# EAGLE design V2 (EAGLE 8.5.1)

## Sheet 1 of 4: Main MCU and crystal
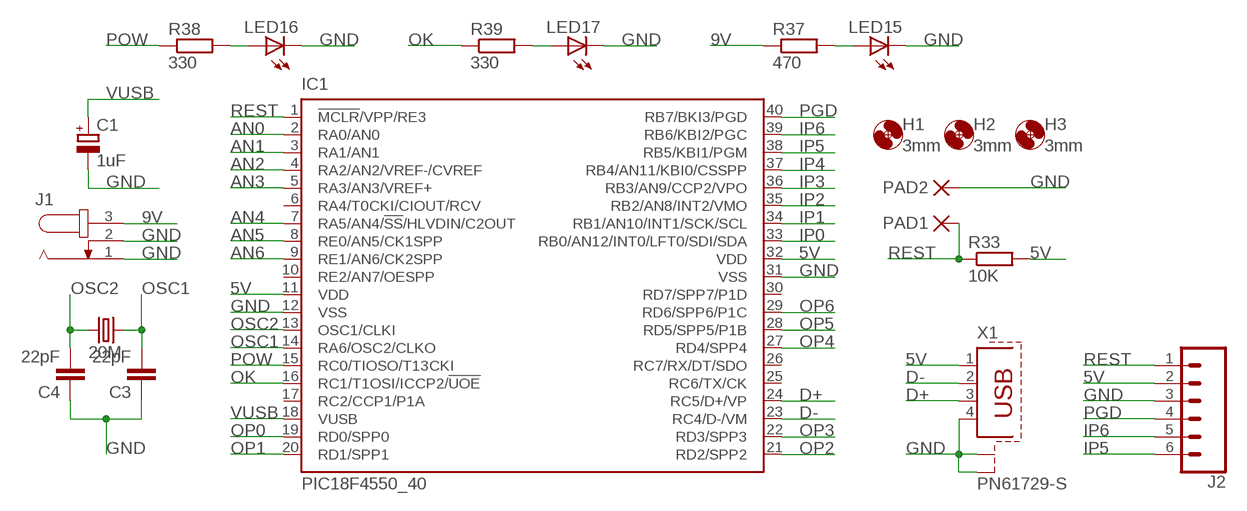
[diagram p0: schematic, sheet 1]

### Parts
20M  CRYSTALHC18U-V  [HC18U-V]
C1  1uF  CPOL-EUE2-5  [E2-5]
C3  22pF  C5/2.5  [C5B2.5]
C4  22pF  C5/2.5  [C5B2.5]
H1  3mm  MOUNT-HOLE3.0  [3,0]
H2  3mm  MOUNT-HOLE3.0  [3,0]
H3  3mm  MOUNT-HOLE3.0  [3,0]
IC1  PIC18F4550_40  [DIL40]
J1  JACK-PLUG0  [SPC4077]
J2  CONN_06LONGPADS  [1X06_LONGPADS]
LED15  LED5MM  [LED5MM]
LED16  LED5MM  [LED5MM]
LED17  LED5MM  [LED5MM]
PAD1  PAD-0320  [0320]
PAD2  PAD-0320  [0320]
R33  10K  R-EU_0207/10  [0207/10]
R37  470  R-EU_0207/10  [0207/10]
R38  330  R-EU_0207/10  [0207/10]
R39  330  R-EU_0207/10  [0207/10]
X1  PN61729-S  [PN61729-S]

### Nets
5V: IC1.11(VDD) IC1.32(VDD) J2.2 R33.2 X1.1 ; also sheet 2
9V: J1.3 R37.1 ; also sheet 4
AN0: IC1.2(RA0/AN0) ; also sheet 4
AN1: IC1.3(RA1/AN1) ; also sheet 4
AN2: IC1.4(RA2/AN2/VREF-/CVREF) ; also sheet 4
AN3: IC1.5(RA3/AN3/VREF+) ; also sheet 4
AN4: IC1.7(RA5/AN4/!SS!/HLVDIN/C2OUT) ; also sheet 4
AN5: IC1.8(RE0/AN5/CK1SPP) ; also sheet 4
AN6: IC1.9(RE1/AN6/CK2SPP) ; also sheet 4
D+: IC1.24(RC5/D+/VP) X1.3
D-: IC1.23(RC4/D-/VM) X1.2
GND: C1.- C3.1 C4.1 IC1.12(VSS) IC1.31(VSS) J1.1 J1.2 J2.3 LED15.K(C) LED16.K(C) LED17.K(C) PAD2.P$1(P) X1.4 X1.S1 X1.S2 ; also sheet 2,3,4
IP0: IC1.33(RB0/AN12/INT0/LFT0/SDI/SDA) ; also sheet 2
IP1: IC1.34(RB1/AN10/INT1/SCK/SCL) ; also sheet 2
IP2: IC1.35(RB2/AN8/INT2/VMO) ; also sheet 2
IP3: IC1.36(RB3/AN9/CCP2/VPO) ; also sheet 2
IP4: IC1.37(RB4/AN11/KBI0/CSSPP) ; also sheet 2
IP5: IC1.38(RB5/KBI1/PGM) J2.6 ; also sheet 2
IP6: IC1.39(RB6/KBI2/PGC) J2.5 ; also sheet 2
N$36: LED15.A R37.2
N$37: LED16.A R38.2
N$38: LED17.A R39.2
OK: IC1.16(RC1/T1OSI/ICCP2/!UOE) R39.1
OP0: IC1.19(RD0/SPP0) ; also sheet 3
OP1: IC1.20(RD1/SPP1) ; also sheet 3
OP2: IC1.21(RD2/SPP2) ; also sheet 3
OP3: IC1.22(RD3/SPP3) ; also sheet 3
OP4: IC1.27(RD4/SPP4) ; also sheet 3
OP5: IC1.28(RD5/SPP5/P1B) ; also sheet 3
OP6: IC1.29(RD6/SPP6/P1C) ; also sheet 3
OSC1: 20M.2 C3.2 IC1.14(RA6/OSC2/CLKO)
OSC2: 20M.1 C4.2 IC1.13(OSC1/CLKI)
PGD: IC1.40(RB7/BKI3/PGD) J2.4
POW: IC1.15(RC0/TIOSO/T13CKI) R38.1
REST: IC1.1(!MCLR!/VPP/RE3) J2.1 PAD1.P$1(P) R33.1
VUSB: C1.+ IC1.18(VUSB)
Unconnected: IC1.6(RA4/T0CKI/CIOUT/RCV) IC1.10(RE2/AN7/OESPP) IC1.17(RC2/CCP1/P1A) IC1.25(RC6/TX/CK) IC1.26(RC7/RX/DT/SDO) IC1.30(RD7/SPP7/P1D)

## Sheet 2 of 4: Input Protection
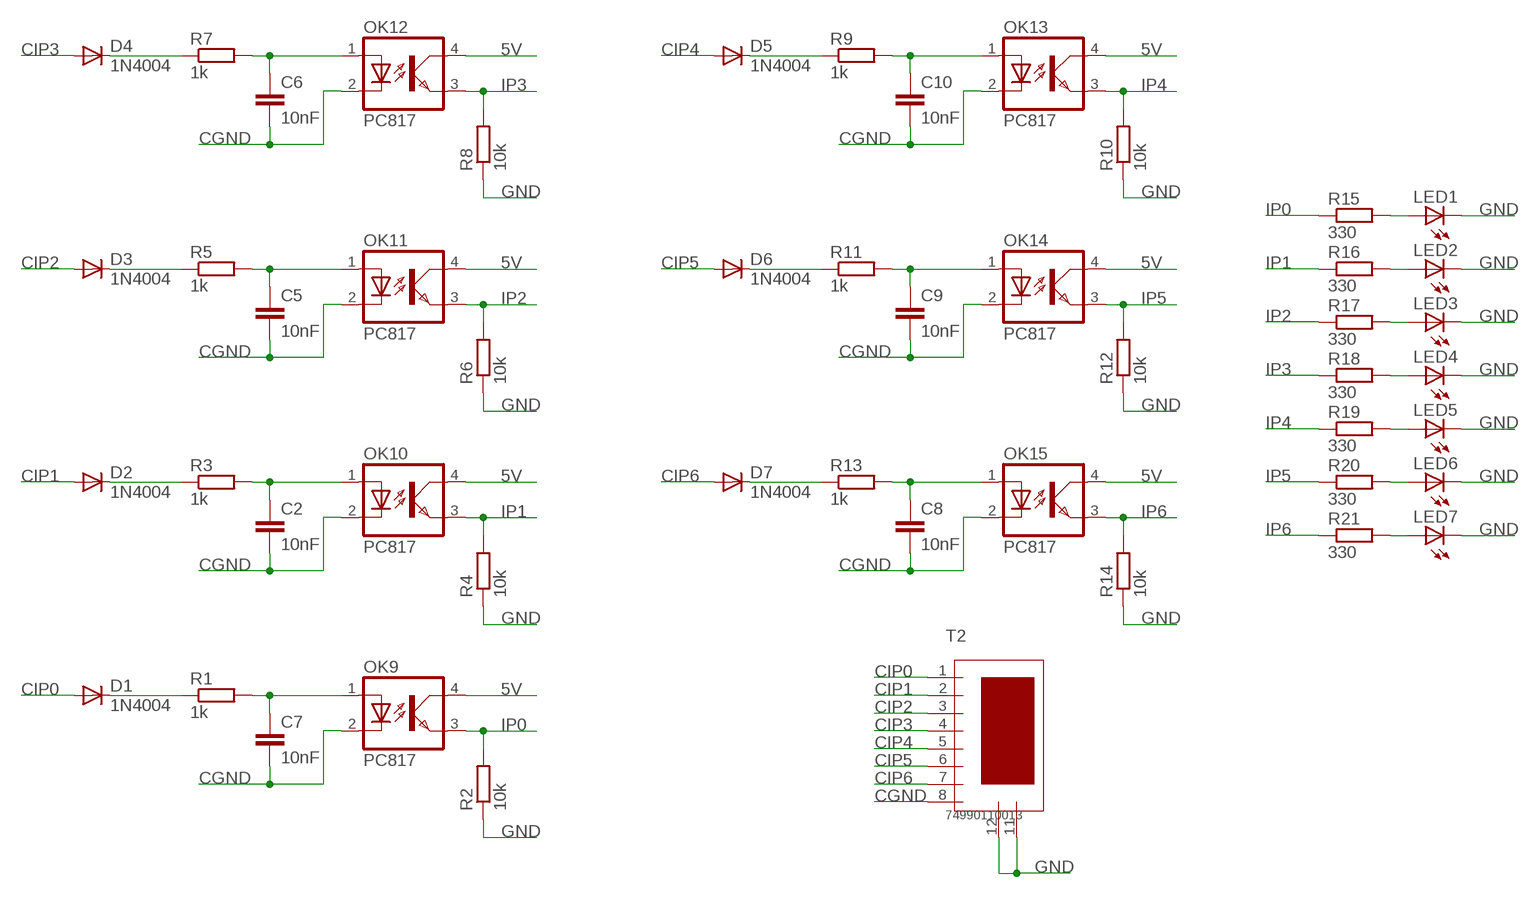
[diagram p1: schematic, sheet 2]

### Parts
C2  10nF  C5/2.5  [C5B2.5]
C5  10nF  C5/2.5  [C5B2.5]
C6  10nF  C5/2.5  [C5B2.5]
C7  10nF  C5/2.5  [C5B2.5]
C8  10nF  C5/2.5  [C5B2.5]
C9  10nF  C5/2.5  [C5B2.5]
C10  10nF  C5/2.5  [C5B2.5]
D1  1N4004  [DO41-10]
D2  1N4004  [DO41-10]
D3  1N4004  [DO41-10]
D4  1N4004  [DO41-10]
D5  1N4004  [DO41-10]
D6  1N4004  [DO41-10]
D7  1N4004  [DO41-10]
LED1  LED5MM  [LED5MM]
LED2  LED5MM  [LED5MM]
LED3  LED5MM  [LED5MM]
LED4  LED5MM  [LED5MM]
LED5  LED5MM  [LED5MM]
LED6  LED5MM  [LED5MM]
LED7  LED5MM  [LED5MM]
OK9  PC817  [DIL04]
OK10  PC817  [DIL04]
OK11  PC817  [DIL04]
OK12  PC817  [DIL04]
OK13  PC817  [DIL04]
OK14  PC817  [DIL04]
OK15  PC817  [DIL04]
R1  1k  R-EU_0207/10  [0207/10]
R2  10k  R-EU_0207/10  [0207/10]
R3  1k  R-EU_0207/10  [0207/10]
R4  10k  R-EU_0207/10  [0207/10]
R5  1k  R-EU_0207/10  [0207/10]
R6  10k  R-EU_0207/10  [0207/10]
R7  1k  R-EU_0207/10  [0207/10]
R8  10k  R-EU_0207/10  [0207/10]
R9  1k  R-EU_0207/10  [0207/10]
R10  10k  R-EU_0207/10  [0207/10]
R11  1k  R-EU_0207/10  [0207/10]
R12  10k  R-EU_0207/10  [0207/10]
R13  1k  R-EU_0207/10  [0207/10]
R14  10k  R-EU_0207/10  [0207/10]
R15  330  R-EU_0207/10  [0207/10]
R16  330  R-EU_0207/10  [0207/10]
R17  330  R-EU_0207/10  [0207/10]
R18  330  R-EU_0207/10  [0207/10]
R19  330  R-EU_0207/10  [0207/10]
R20  330  R-EU_0207/10  [0207/10]
R21  330  R-EU_0207/10  [0207/10]
T2  74990110013  [01LAN_RJ45_10/00_STD]

### Nets
5V: OK9.4(COL) OK10.4(COL) OK11.4(COL) OK12.4(COL) OK13.4(COL) OK14.4(COL) OK15.4(COL) ; also sheet 1
CGND: C2.2 C5.2 C6.2 C7.2 C8.2 C9.2 C10.2 OK9.2(C) OK10.2(C) OK11.2(C) OK12.2(C) OK13.2(C) OK14.2(C) OK15.2(C) T2.8
CIP0: D1.A T2.1
CIP1: D2.A T2.2
CIP2: D3.A T2.3
CIP3: D4.A T2.4
CIP4: D5.A T2.5
CIP5: D6.A T2.6
CIP6: D7.A T2.7
GND: LED1.K(C) LED2.K(C) LED3.K(C) LED4.K(C) LED5.K(C) LED6.K(C) LED7.K(C) R2.1 R4.1 R6.1 R8.1 R10.1 R12.1 R14.1 T2.11 T2.12 ; also sheet 1,3,4
IP0: OK9.3(EMIT) R2.2 R15.1 ; also sheet 1
IP1: OK10.3(EMIT) R4.2 R16.1 ; also sheet 1
IP2: OK11.3(EMIT) R6.2 R17.1 ; also sheet 1
IP3: OK12.3(EMIT) R8.2 R18.1 ; also sheet 1
IP4: OK13.3(EMIT) R10.2 R19.1 ; also sheet 1
IP5: OK14.3(EMIT) R12.2 R20.1 ; also sheet 1
IP6: OK15.3(EMIT) R14.2 R21.1 ; also sheet 1
N$1: D1.C R1.1
N$2: C7.1 OK9.1(A) R1.2
N$3: D2.C R3.1
N$5: C2.1 OK10.1(A) R3.2
N$7: D3.C R5.1
N$8: C5.1 OK11.1(A) R5.2
N$9: D4.C R7.1
N$10: C6.1 OK12.1(A) R7.2
N$11: D5.C R9.1
N$12: C10.1 OK13.1(A) R9.2
N$13: D6.C R11.1
N$14: C9.1 OK14.1(A) R11.2
N$16: D7.C R13.1
N$17: C8.1 OK15.1(A) R13.2
N$18: LED1.A R15.2
N$19: LED2.A R16.2
N$22: LED3.A R17.2
N$23: LED4.A R18.2
N$24: LED5.A R19.2
N$25: LED6.A R20.2
N$26: LED7.A R21.2

## Sheet 3 of 4: Output Protection
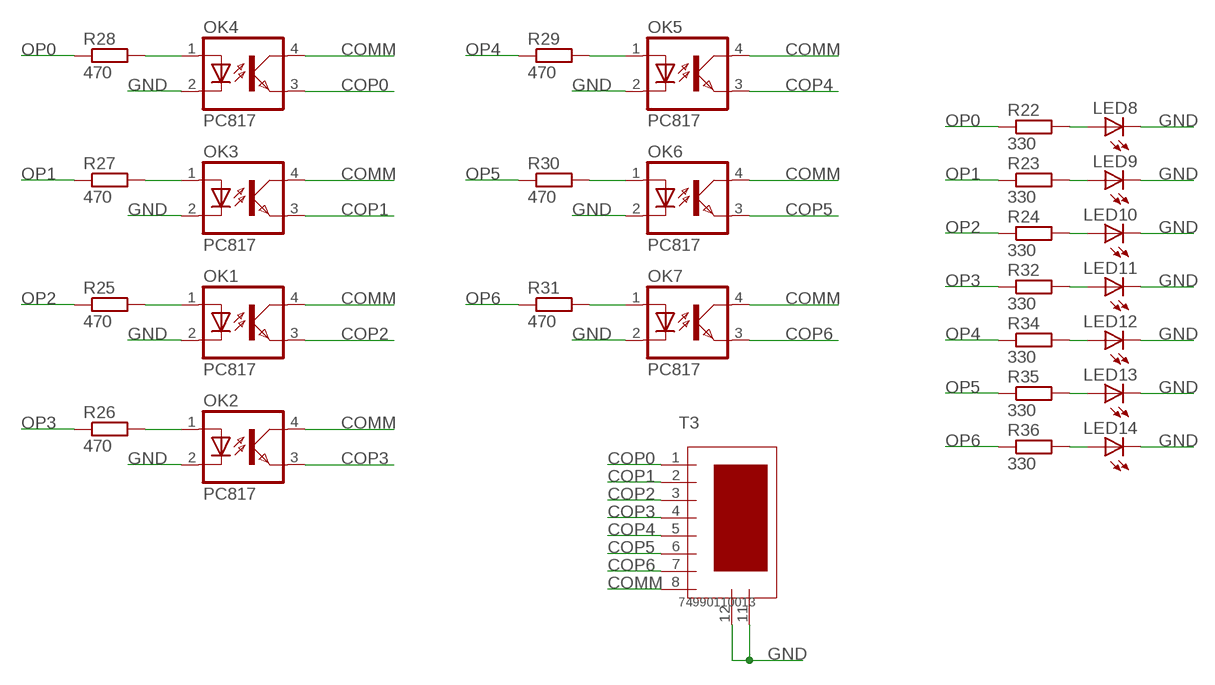
[diagram p2: schematic, sheet 3]

### Parts
LED8  LED5MM  [LED5MM]
LED9  LED5MM  [LED5MM]
LED10  LED5MM  [LED5MM]
LED11  LED5MM  [LED5MM]
LED12  LED5MM  [LED5MM]
LED13  LED5MM  [LED5MM]
LED14  LED5MM  [LED5MM]
OK1  PC817  [DIL04]
OK2  PC817  [DIL04]
OK3  PC817  [DIL04]
OK4  PC817  [DIL04]
OK5  PC817  [DIL04]
OK6  PC817  [DIL04]
OK7  PC817  [DIL04]
R22  330  R-EU_0207/10  [0207/10]
R23  330  R-EU_0207/10  [0207/10]
R24  330  R-EU_0207/10  [0207/10]
R25  470  R-EU_0207/10  [0207/10]
R26  470  R-EU_0207/10  [0207/10]
R27  470  R-EU_0207/10  [0207/10]
R28  470  R-EU_0207/10  [0207/10]
R29  470  R-EU_0207/10  [0207/10]
R30  470  R-EU_0207/10  [0207/10]
R31  470  R-EU_0207/10  [0207/10]
R32  330  R-EU_0207/10  [0207/10]
R34  330  R-EU_0207/10  [0207/10]
R35  330  R-EU_0207/10  [0207/10]
R36  330  R-EU_0207/10  [0207/10]
T3  74990110013  [01LAN_RJ45_10/00_STD]

### Nets
COMM: OK1.4(COL) OK2.4(COL) OK3.4(COL) OK4.4(COL) OK5.4(COL) OK6.4(COL) OK7.4(COL) T3.8
COP0: OK4.3(EMIT) T3.1
COP1: OK3.3(EMIT) T3.2
COP2: OK1.3(EMIT) T3.3
COP3: OK2.3(EMIT) T3.4
COP4: OK5.3(EMIT) T3.5
COP5: OK6.3(EMIT) T3.6
COP6: OK7.3(EMIT) T3.7
GND: LED8.K(C) LED9.K(C) LED10.K(C) LED11.K(C) LED12.K(C) LED13.K(C) LED14.K(C) OK1.2(C) OK2.2(C) OK3.2(C) OK4.2(C) OK5.2(C) OK6.2(C) OK7.2(C) T3.11 T3.12 ; also sheet 1,2,4
N$4: OK1.1(A) R25.2
N$6: OK2.1(A) R26.2
N$15: OK3.1(A) R27.2
N$20: OK4.1(A) R28.2
N$21: LED8.A R22.2
N$27: OK5.1(A) R29.2
N$28: LED9.A R23.2
N$29: LED10.A R24.2
N$30: LED11.A R32.2
N$31: LED12.A R34.2
N$32: OK6.1(A) R30.2
N$33: LED13.A R35.2
N$34: LED14.A R36.2
N$35: OK7.1(A) R31.2
OP0: R22.1 R28.1 ; also sheet 1
OP1: R23.1 R27.1 ; also sheet 1
OP2: R24.1 R25.1 ; also sheet 1
OP3: R26.1 R32.1 ; also sheet 1
OP4: R29.1 R34.1 ; also sheet 1
OP5: R30.1 R35.1 ; also sheet 1
OP6: R31.1 R36.1 ; also sheet 1

## Sheet 4 of 4: Analog Protection
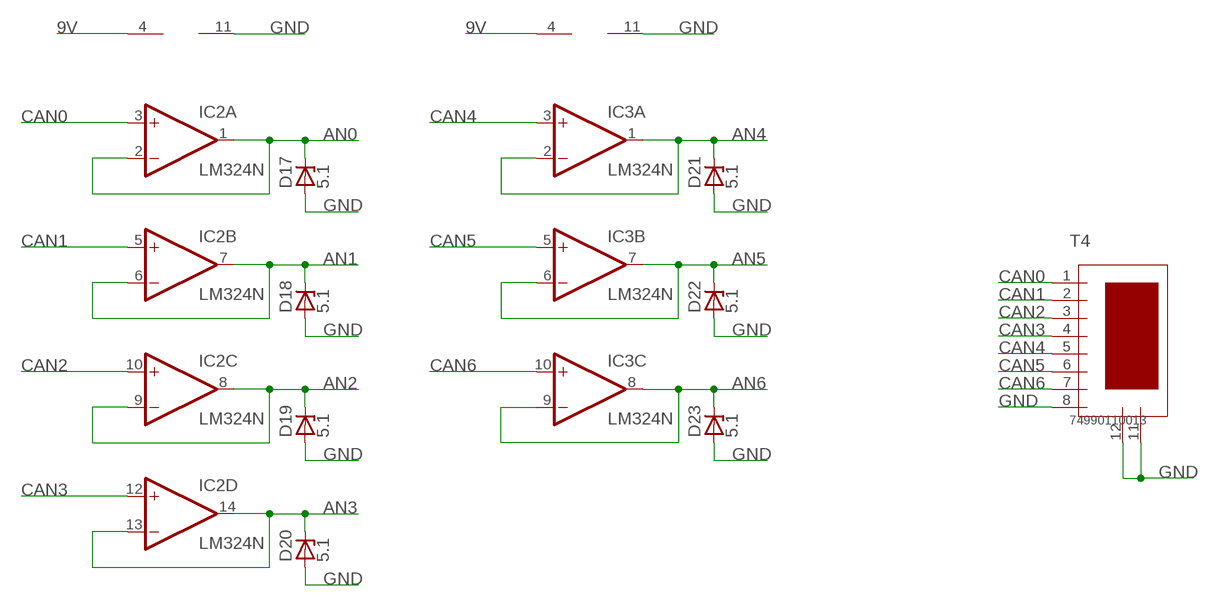
[diagram p3: schematic, sheet 4]

### Parts
D17  5.1  ZENER-DIODEZD-10  [ZDIO-10]
D18  5.1  ZENER-DIODEZD-10  [ZDIO-10]
D19  5.1  ZENER-DIODEZD-10  [ZDIO-10]
D20  5.1  ZENER-DIODEZD-10  [ZDIO-10]
D21  5.1  ZENER-DIODEZD-10  [ZDIO-10]
D22  5.1  ZENER-DIODEZD-10  [ZDIO-10]
D23  5.1  ZENER-DIODEZD-10  [ZDIO-10]
IC2  LM324N  [DIL14]
IC3  LM324N  [DIL14]
T4  74990110013  [01LAN_RJ45_10/00_STD]

### Nets
9V: IC2.4(P:V+) IC3.4(P:V+) ; also sheet 1
AN0: D17.C IC2.1(A:OUT) IC2.2(A:-IN) ; also sheet 1
AN1: D18.C IC2.6(B:-IN) IC2.7(B:OUT) ; also sheet 1
AN2: D19.C IC2.8(C:OUT) IC2.9(C:-IN) ; also sheet 1
AN3: D20.C IC2.13(D:-IN) IC2.14(D:OUT) ; also sheet 1
AN4: D21.C IC3.1(A:OUT) IC3.2(A:-IN) ; also sheet 1
AN5: D22.C IC3.6(B:-IN) IC3.7(B:OUT) ; also sheet 1
AN6: D23.C IC3.8(C:OUT) IC3.9(C:-IN) ; also sheet 1
CAN0: IC2.3(A:+IN) T4.1
CAN1: IC2.5(B:+IN) T4.2
CAN2: IC2.10(C:+IN) T4.3
CAN3: IC2.12(D:+IN) T4.4
CAN4: IC3.3(A:+IN) T4.5
CAN5: IC3.5(B:+IN) T4.6
CAN6: IC3.10(C:+IN) T4.7
GND: D17.A D18.A D19.A D20.A D21.A D22.A D23.A IC2.11(P:V-) IC3.11(P:V-) T4.8 T4.11 T4.12 ; also sheet 1,2,3
Unconnected: IC3.12(D:+IN) IC3.13(D:-IN) IC3.14(D:OUT)

## Library data of the parts
20M = adafruit:CRYSTAL: CRYSTAL; OC_FARNELL: unknown; OC_NEWARK: unknown
C1 = rcl:CPOL-EU: POLARIZED CAPACITOR, European symbol; SPICEPREFIX: C
C2-C10 = capacitor-wima:C: CAPACITOR naming: grid - package width
D1-D7 = adafruit:1N4004: DIODE General purpose 1N400x type rectifier (With bigger pads) http://www.ladyada.net/library/pcb/eaglelibrary.html
D17-D23 = diode-1:ZENER-DIODE: Z-Diode
H1-H3 = holes:MOUNT-HOLE: MOUNTING HOLE with drill center marker
IC1 = microchip:PIC18F4*_40: USB Microcontrollers with nanoWatt Technology High-Performance, Enhanced Flash, 28/40/44-Pin, Source: http://ww1.microchip.com/downloads/en/devicedoc/39632c.pdf; MF: MICROCHIP; MPN: PIC18F4550-I/P; OC_FARNELL: 9321357; OC_NEWARK: 74K8623
IC2 IC3 = linear:LM324: OP AMP
J1 = con-jack:JACK-PLUG: DC POWER JACK Power Jack, DC, Right Angle, Through Hole, Rated 5A at 16VDC, PC Terminals Distributor: Farnell (www.Farnell.de) Drawing: 84N1161.pdf / 84N1162.pdf Manufacturer: SPC Technology (www.spctechnology.com) Type: SPC4077 / SPC 4078; OC_FARNELL: unknown; OC_NEWARK: unknown
J2 = SparkFun-Connectors:CONN_06: Multi connection point. Often used as Generic Header-pin footprint for 0.1 inch spaced/style header connections On any of the 0.1 inch spaced packages, you can populate with these: Break Away Headers - Straight <https://www.sparkfun.com/products/116> (PRT-00116) Break Away Male Headers - Right Angle <https://www.sparkfun.com/products/553> (PRT-00553) Female Headers <https://www.sparkfun.com/products/115> (PRT-00115) Break Away Headers - Machine Pin <https://www.sparkfun.com/products/117> (PRT-00117) Break Away Female Headers - Swiss Machine Pin <https://www.sparkfun.com/products/743> (PRT-00743) Arduino Stackable Header - 6 Pin <https://www.sparkfun.com/products/9280> (PRT-09280) For SCREWTERMINALS and SPRING TERMINALS visit here: Screw Terimnals on SparkFun.com <https://www.sparkfun.com/search/results?term=Screw+Terminals> (5mm/3.5mm/2.54mm spacing) This device is also useful as a general connection point to wire up your design to another part of your project. Our various solder wires solder well into these plated through hole pads. Hook-Up Wire - Assortment (Stranded, 22 AWG) <https://www.sparkfun.com/products/11375> (PRT-11375) Hook-Up Wire - Assortment (Solid Core, 22 AWG) <https://www.sparkfun.com/products/11367> (PRT-11367) View the entire wire category on our website here <https://www.sparkfun.com/categories/141>
LED1-LED17 = led:LED: LED OSRAM: - CHIPLED LG R971, LG N971, LY N971, LG Q971, LY Q971, LO R971, LY R971 LH N974, LH R974 LS Q976, LO Q976, LY Q976 LO Q996 - Hyper CHIPLED LW Q18S LB Q993, LB Q99A, LB R99A - SideLED LS A670, LO A670, LY A670, LG A670, LP A670 LB A673, LV A673, LT A673, LW A673 LH A674 LY A675 LS A676, LA A676, LO A676, LY A676, LW A676 LS A679, LY A679, LG A679 - Hyper Micro SIDELED® LS Y876, LA Y876, LO Y876, LY Y876 LT Y87S - SmartLED LW L88C, LW L88S LB L89C, LB L89S, LG L890 LS L89K, LO L89K, LY L89K LS L896, LA L896, LO L896, LY L896 - TOPLED LS T670, LO T670, LY T670, LG T670, LP T670 LSG T670, LSP T670, LSY T670, LOP T670, LYG T670 LG T671, LOG T671, LSG T671 LB T673, LV T673, LT T673, LW T673 LH T674 LS T676, LA T676, LO T676, LY T676, LB T676, LH T676, LSB T676, LW T676 LB T67C, LV T67C, LT T67C, LS T67K, LO T67K, LY T67K, LW E67C LS E67B, LA E67B, LO E67B, LY E67B, LB E67C, LV E67C, LT E67C LW T67C LS T679, LY T679, LG T679 LS T770, LO T770, LY T770, LG T770, LP T770 LB T773, LV T773, LT T773, LW T773 LH T774 LS E675, LA E675, LY E675, LS T675 LS T776, LA T776, LO T776, LY T776, LB T776 LHGB T686 LT T68C, LB T68C - Hyper Mini TOPLED® LB M676 - Mini TOPLED Santana® LG M470 LS M47K, LO M47K, LY M47K Source: http://www.osram.convergy.de LUXEON: - LUMILED® LXK2-PW12-R00, LXK2-PW12-S00, LXK2-PW14-U00, LXK2-PW14-V00 LXK2-PM12-R00, LXK2-PM12-S00, LXK2-PM14-U00 LXK2-PE12-Q00, LXK2-PE12-R00, LXK2-PE12-S00, LXK2-PE14-T00, LXK2-PE14-U00 LXK2-PB12-K00, LXK2-PB12-L00, LXK2-PB12-M00, LXK2-PB14-N00, LXK2-PB14-P00, LXK2-PB14-Q00 LXK2-PR12-L00, LXK2-PR12-M00, LXK2-PR14-Q00, LXK2-PR14-R00 LXK2-PD12-Q00, LXK2-PD12-R00, LXK2-PD12-S00 LXK2-PH12-R00, LXK2-PH12-S00 LXK2-PL12-P00, LXK2-PL12-Q00, LXK2-PL12-R00 Source: www.luxeon.com KINGBRIGHT: KA-3528ASYC Source: www.kingbright.com
OK1-OK7 OK9-OK15 = optocoupler:PC817: SHARP OPTO COUPLER; MPN: PC817X4J000F; OC_FARNELL: 9707727; OC_NEWARK: 97K7059
PAD1 PAD2 = dpads:PAD: WIRE PAD Standard US Drill Sizes and SMD pads
R1-R24 R32 R34-R39 = rcl:R-EU_: RESISTOR, European symbol; SPICEPREFIX: R
R25-R31 R33 = rcl:R-EU_: RESISTOR, European symbol
T2-T4 = wurth_electronics_midcom_inc_v1-0:74990110013: Package Style: HPLE RJ45 10/100 STD Mounting: THT LED: None Shield: 293-0533 Header: 183-0132 Windings Primary: Aux: Secondary: Best pinouts for production vary per application. Please contact Wurth Electronics Midcom, Inc. for assistance with your custom design. Datasheet: 74990110013 <http://katalog.we-online.de/kataloge/eisos/media/pdf/74990110013.pdf> Website: Wurth Electronics Midcom <http://www.we-online.com/midcom> Contact us Wurth Electronics Midcom, Inc. 121 Airport Dr. Watertown, SD 57201 Phone: (605) 886-4385 Fax: (605) 886-4486 E-Mail: midcom@we-online.com
X1 = con-berg:PN61729-S: BERG USB connector; OC_FARNELL: unknown; OC_NEWARK: unknown

## Board
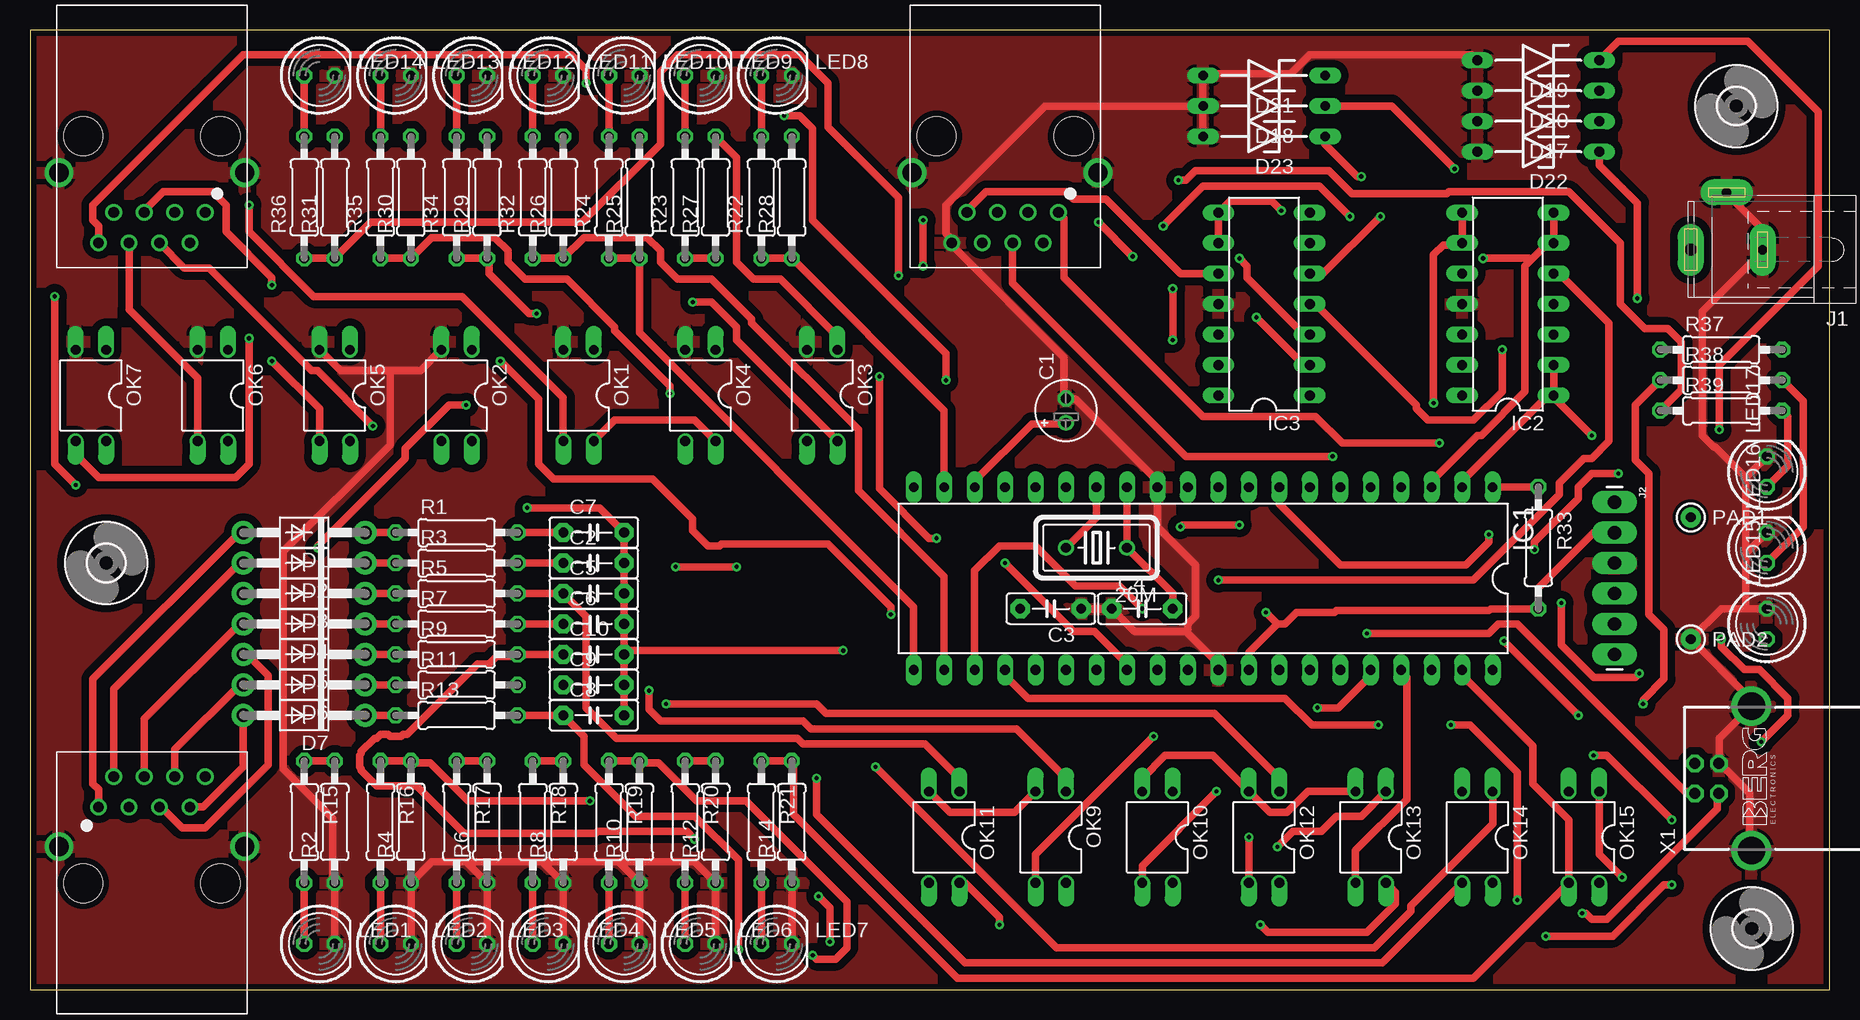
[diagram p4: board, top side]
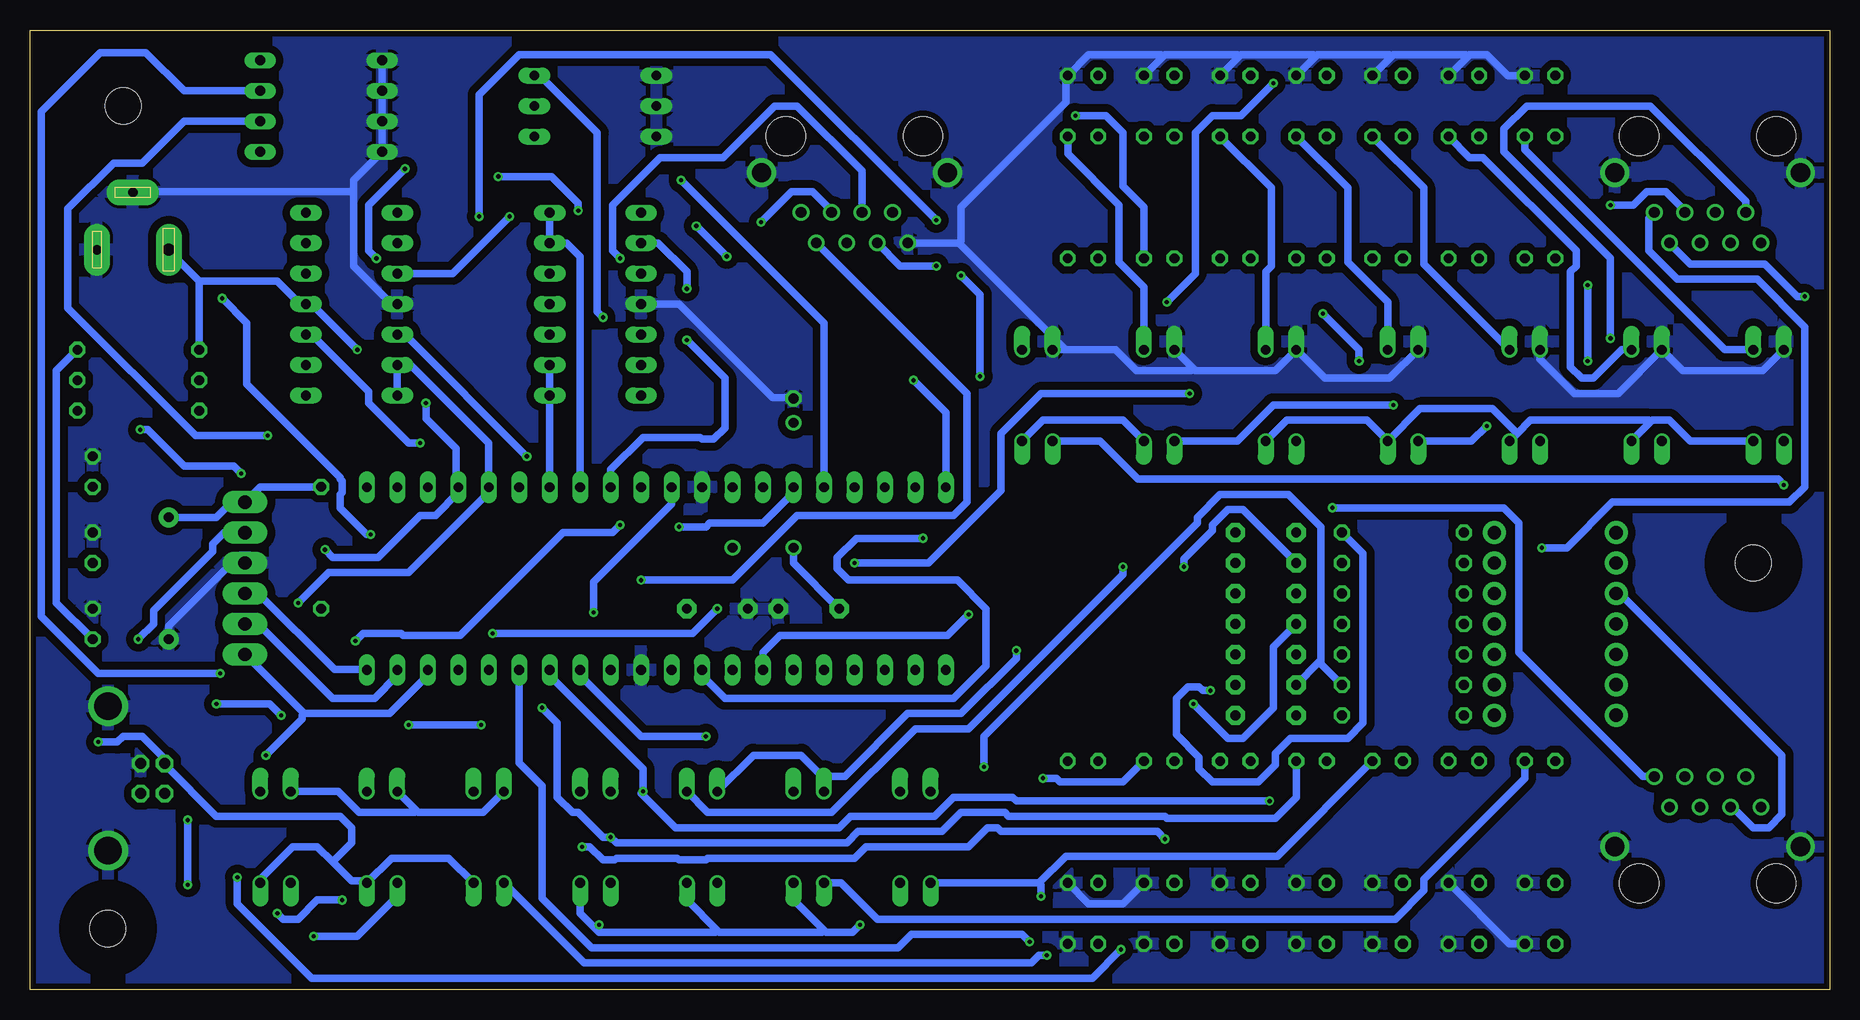
[diagram p5: board, bottom side, seen from below]

Size 150 x 80 mm. Coordinates in mm from the lower left corner, seen from the top.
Outline: 0,0 150,0 150,80 0,80 0,0
Copper layers (1*16): Top 0.035mm / dielectric 1.5mm / Bottom 0.035mm
Design rules "default *": minimum track width 25mil, minimum drill 0.35mm, track to track 25mil, track to pad 25mil, pad to pad 6mil, via to via 6mil, smd to smd 6mil, copper to edge 20mil, drill to drill 6mil, minimum pad ring 10mil, minimum via ring 8mil, stop-mask expansion 4mil, vias tented up to drill 0mil, thermal gap 10mil

### Footprints (pad centres in the part's own frame; a part is rotated, then mirrored left to right if it is on the bottom)
HC18U-V = drill 0.813: 1 -2.54,0; 2 2.54,0
E2-5 = drill 0.813 pad 1.27: + -1.016,0 | drill 0.813 pad 1.27 octagon: - 1.016,0
C5B2.5 = drill 0.813 pad 1.6 octagon: 1 -2.54,0; 2 2.54,0
DO41-10 = drill 1.118 pad 1.93: A 5.08,0; C -5.08,0
ZDIO-10 = drill 0.813 long: A 5.08,0; C -5.08,0
3,0 = hole 3: 0,0
DIL40 = drill 0.813 long: 1 -24.13,-7.62; 2 -21.59,-7.62; 3 -19.05,-7.62; 4 -16.51,-7.62; 5 -13.97,-7.62; 6 -11.43,-7.62; 7 -8.89,-7.62; 8 -6.35,-7.62; 9 -3.81,-7.62; 10 -1.27,-7.62; 11 1.27,-7.62; 12 3.81,-7.62; 13 6.35,-7.62; 14 8.89,-7.62; 15 11.43,-7.62; 16 13.97,-7.62; 17 16.51,-7.62; 18 19.05,-7.62; 19 21.59,-7.62; 20 24.13,-7.62; 21 24.13,7.62; 22 21.59,7.62; 23 19.05,7.62; 24 16.51,7.62; 25 13.97,7.62; 26 11.43,7.62; 27 8.89,7.62; 28 6.35,7.62; 29 3.81,7.62; 30 1.27,7.62; 31 -1.27,7.62; 32 -3.81,7.62; 33 -6.35,7.62; 34 -8.89,7.62; 35 -11.43,7.62; 36 -13.97,7.62; 37 -16.51,7.62; 38 -19.05,7.62; 39 -21.59,7.62; 40 -24.13,7.62
DIL14 = drill 0.813 long: 1 -7.62,-3.81; 2 -5.08,-3.81; 3 -2.54,-3.81; 4 0,-3.81; 5 2.54,-3.81; 6 5.08,-3.81; 7 7.62,-3.81; 8 7.62,3.81; 9 5.08,3.81; 10 2.54,3.81; 11 0,3.81; 12 -2.54,3.81; 13 -5.08,3.81; 14 -7.62,3.81
SPC4077 = drill 0.8 pad 2.184 long: 1 -3,0; 2 0,-4.8 | drill 1 pad 2.184 long: 3 3,0
1X06_LONGPADS = drill 1.118 pad 1.88 long: 1 0,0; 2 2.54,0; 3 5.08,0; 4 7.62,0; 5 10.16,0; 6 12.7,0
LED5MM = drill 0.813 octagon: A -1.27,0; K 1.27,0
DIL04 = drill 0.813 offset: 1 -1.27,-3.81; 2 1.27,-3.81; 3 1.27,3.81; 4 -1.27,3.81
0320 = drill 0.813 pad 1.676: P$1 0,0
0207/10 = drill 0.813 octagon: 1 -5.08,0; 2 5.08,0
01LAN_RJ45_10/00_STD = drill 0.889: 1 4.445,-6.325; 2 3.175,-8.865; 3 1.905,-6.325; 4 0.635,-8.865; 5 -0.635,-6.325; 6 -1.905,-8.865; 7 -3.175,-6.325; 8 -4.445,-8.865 | drill 1.6: 11 -7.747,-3.023; 12 7.747,-3.023 | hole 3.251: -5.715,0.025; 5.715,0.025
PN61729-S = drill 0.95 octagon: 1 1.25,4.71; 2 -1.25,4.71; 3 -1.25,2.71; 4 1.25,2.71 | drill 2.3 pad 2.9: S1 -6.02,0; S2 6.02,0

### Placement (x,y rotation side)
20M  88.9,36.83 180 top
C1  86.36,48.26 90 top
C2  46.99,35.56 0 top
C3  85.09,31.75 180 top
C4  92.71,31.75 0 top
C5  46.99,33.02 0 top
C6  46.99,30.48 0 top
C7  46.99,38.1 0 top
C8  46.99,22.86 0 top
C9  46.99,25.4 0 top
C10  46.99,27.94 0 top
D1  22.86,38.1 180 top
D2  22.86,35.56 180 top
D3  22.86,33.02 180 top
D4  22.86,30.48 180 top
D5  22.86,27.94 180 top
D6  22.86,25.4 180 top
D7  22.86,22.86 180 top
D17  125.73,72.39 180 top
D18  102.87,73.66 180 top
D19  125.73,77.47 180 top
D20  125.73,74.93 180 top
D21  102.87,76.2 180 top
D22  125.73,69.85 180 top
D23  102.87,71.12 180 top
H1  142.24,73.66 0 top
H2  143.51,5.08 0 top
H3  6.35,35.56 0 top
IC1  97.79,34.26 180 top
IC2  123.19,57.15 90 top
IC3  102.87,57.15 90 top
J1  141.43,61.67 180 top
J2  132.08,40.64 270 top
LED1  24.13,3.81 0 top
LED2  30.48,3.81 0 top
LED3  36.83,3.81 0 top
LED4  43.18,3.81 0 top
LED5  49.53,3.81 0 top
LED6  55.88,3.81 0 top
LED7  62.23,3.81 0 top
LED8  62.23,76.2 0 top
LED9  55.88,76.2 0 top
LED10  49.53,76.2 0 top
LED11  43.18,76.2 0 top
LED12  36.83,76.2 0 top
LED13  30.48,76.2 0 top
LED14  24.13,76.2 0 top
LED15  144.78,30.48 90 top
LED16  144.78,36.83 90 top
LED17  144.78,43.18 90 top
OK1  45.72,49.53 180 top
OK2  35.56,49.53 180 top
OK3  66.04,49.53 180 top
OK4  55.88,49.53 180 top
OK5  25.4,49.53 180 top
OK6  15.24,49.53 180 top
OK7  5.08,49.53 180 top
OK9  85.09,12.7 180 top
OK10  93.98,12.7 180 top
OK11  76.2,12.7 180 top
OK12  102.87,12.7 180 top
OK13  111.76,12.7 180 top
OK14  120.65,12.7 180 top
OK15  129.54,12.7 180 top
PAD1  138.43,39.37 0 top
PAD2  138.43,29.21 0 top
R1  35.56,38.1 0 top
R2  25.4,13.97 90 top
R3  35.56,35.56 0 top
R4  31.75,13.97 90 top
R5  35.56,33.02 0 top
R6  38.1,13.97 90 top
R7  35.56,30.48 0 top
R8  44.45,13.97 90 top
R9  35.56,27.94 0 top
R10  50.8,13.97 90 top
R11  35.56,25.4 0 top
R12  57.15,13.97 90 top
R13  35.56,22.86 0 top
R14  63.5,13.97 90 top
R15  22.86,13.97 270 top
R16  29.21,13.97 270 top
R17  35.56,13.97 270 top
R18  41.91,13.97 270 top
R19  48.26,13.97 270 top
R20  54.61,13.97 270 top
R21  60.96,13.97 270 top
R22  60.96,66.04 90 top
R23  54.61,66.04 90 top
R24  48.26,66.04 90 top
R25  50.8,66.04 90 top
R26  44.45,66.04 90 top
R27  57.15,66.04 90 top
R28  63.5,66.04 90 top
R29  38.1,66.04 90 top
R30  31.75,66.04 90 top
R31  25.4,66.04 90 top
R32  41.91,66.04 90 top
R33  125.73,36.83 270 top
R34  35.56,66.04 90 top
R35  29.21,66.04 90 top
R36  22.86,66.04 90 top
R37  140.97,53.34 0 top
R38  140.97,50.8 0 top
R39  140.97,48.26 0 top
T2  10.16,8.89 180 top
T3  10.16,71.12 0 top
T4  81.28,71.12 0 top
X1  143.48,17.6 90 top

### Tracks (layer width: path | path; a pad name or v marks a point on that pad's centre or on a via)
5V  (via drill 0.35)
  Top 0.635: J2.2 130.33,38.1 125.73,33.5 R33.2 121.76,31.75 121.6,31.59 108.9,31.59 108.74,31.43 105.57,31.43 104.62,30.48 103.98,30.48 | IC1.32 101.6,28.1 103.98,30.48 | 103.98,30.48 v103.03,31.43 | OK11.4 77.95,8.89 80.8,6.03 v80.8,5.4 | OK13.4 113.82,8.1 113.82,7.14 111.44,4.76 103.19,4.76 v102.55,5.4 | v140.97,29.21 140.97,28.57 142.88,26.67 144.15,26.67 146.53,24.29 146.53,22.86 v144.3,20.64
  Bottom 0.635: IC1.11 96.52,40.48 103.03,33.97 v103.03,31.43 | v80.8,5.4 81.44,4.76 83.66,4.76 83.82,4.92 | 83.82,4.92 86.36,7.46 OK9.4 | OK10.4 95.25,7.46 92.71,4.92 | 92.71,4.92 92.55,4.76 83.98,4.76 83.82,4.92 | OK12.4 104.14,6.35 102.87,5.08 | 102.87,5.08 102.55,4.76 92.87,4.76 92.71,4.92 | v102.55,5.4 102.87,5.08 | OK13.4 115.09,10.95 119.86,10.95 OK14.4 122.08,9.05 123.19,9.05 124.78,10.64 | OK15.4 130.81,9.21 128.11,11.91 126.05,11.91 124.78,10.64 | 124.78,10.64 123.19,12.22 123.19,13.49 124.14,14.45 134.46,14.45 138.75,18.73 X1.1 138.59,19.05 140.65,21.11 142.24,21.11 142.72,20.64 v144.3,20.64 | J2.2 133.83,38.1 134.78,37.15 134.78,36.51 139.7,31.59 139.7,30.48 v140.97,29.21
9V  (via drill 0.35)
  Top 0.635: IC3.4 107.16,57.15 115.57,48.74 115.57,48.42 116.52,47.47 120.33,47.47 122.71,49.85 v122.71,53.34
  Bottom 0.635: 135.89,59.05 R37.1 | 135.89,59.05 138.43,61.59 J1.3 | v122.71,53.34 126.52,57.15 IC2.4 127.16,57.31 127.64,57.31 129.38,59.05 135.89,59.05
AN0  (via drill 0.35)
  Top 0.635: IC1.2 119.38,42.39 126.52,49.53 IC2.1 | IC2.1 IC2.2 | v130.18,46.2 127,49.37 IC2.1
  Bottom 0.635: D17.C 137.16,72.39 140.65,68.9 143.03,68.9 146.84,65.09 146.84,56.83 136.21,46.2 v130.18,46.2
AN1  (via drill 0.35)
  Top 0.635: IC1.3 116.84,42.39 120.65,46.2 120.97,46.2 124.62,49.85 124.62,60.33 125.09,60.8 | 125.09,60.8 126.52,62.23 IC2.6 IC2.7 | D18.C 113.51,73.66 v118.75,68.42 | v121.13,60.96 124.94,60.96 125.09,60.8
  Bottom 0.635: v118.75,68.42 121.76,65.41 121.76,61.59 v121.13,60.96
AN2  (via drill 0.35)
  Top 0.635: IC2.8 IC2.9 119.22,62.07 117.79,62.07 117,61.28 v117,48.9 | D19.C 132.4,79.06 143.19,79.06 149.07,73.18 149.07,60.33 140.81,52.07 v140.81,46.67 | v132.4,43.02 130.18,43.02 129.06,41.91 129.06,40.96 125.41,37.31 v125.41,36.67
  Bottom 0.635: v140.81,46.67 140.18,46.67 137.16,43.66 133.03,43.66 v132.4,43.02 | v125.41,36.67 124.78,36.04 120.97,36.04 117.47,39.53 116.2,39.53 114.3,41.43 IC1.4 114.46,42.07 114.46,45.09 117,47.62 v117,48.9
AN3  (via drill 0.35)
  Top 0.635: v134.14,26.35 133.83,26.04 130.33,26.04 127.64,28.73 v127.64,32.23
  Bottom 0.635: IC2.14 IC2.13 118.27,52.07 111.76,45.56 IC1.5 111.76,41.43 118.43,34.77 125.09,34.77 v127.64,32.23 | D20.C 137.16,74.93 140.34,78.11 144.15,78.11 149.07,73.18 149.07,31.11 144.3,26.35 v134.14,26.35
AN4  (via drill 0.35)
  Top 0.635: v102.23,56.04 106.2,52.07 IC3.2
  Bottom 0.635: IC1.7 IC3.1 IC3.2 | D21.C 107.47,76.2 102.71,71.44 102.71,56.52 v102.23,56.04
AN5  (via drill 0.35)
  Top 0.635: D22.C 130.81,68.74 133.99,65.56 v133.99,57.63 | v121.6,37.94 121.6,37.31 119.7,35.4 109.22,35.4 104.14,40.48 IC1.8
  Bottom 0.635: IC1.8 104.14,61.12 105.25,62.23 IC3.6 IC3.7 | v133.99,57.63 131.92,55.56 131.92,50.48 124.14,42.7 124.14,42.55 123.98,42.39 123.98,41.43 124.14,41.27 124.14,40.16 121.92,37.94 v121.6,37.94
AN6  (via drill 0.35)
  Top 0.635: IC3.9 IC3.8 100.01,65.72 103.5,65.72 v104.3,64.93 | v95.25,58.42 v95.25,54.13 | D23.C 107.95,70.48 110.65,67.79 v110.97,67.79
  Bottom 0.635: IC1.9 101.6,43.34 98.9,46.04 94.14,46.04 93.98,45.88 93.03,45.88 92.08,46.83 92.08,50.96 v95.25,54.13 | v95.25,58.42 95.25,59.85 97.63,62.23 IC3.9 | v110.97,67.79 106.52,67.79 104.3,65.56 v104.3,64.93
CAN0  (via drill 0.35)
  Top 0.635: v117.47,45.56 109.38,45.56 107.16,47.78 97.79,47.78 86.2,59.37 86.2,64.29 85.72,64.77 T4.1
  Bottom 0.635: IC2.3 126.52,54.61 121.76,49.85 121.76,48.9 118.43,45.56 v117.47,45.56
CAN1  (via drill 0.35)
  Top 0.635: IC2.5 127.48,59.69 131.6,55.56 131.6,45.72 130.18,44.29 129.54,44.29 127.48,42.23 127.48,41.27 120.33,34.13 v99.06,34.13
  Bottom 0.635: v99.06,34.13 91.44,34.13 86.04,39.53 73.03,39.53 71.91,40.64 71.91,49.69 84.45,62.23 T4.2
CAN2  (via drill 0.35)
  Top 0.635: v110.01,64.45 107.47,66.99 97.79,66.99 v94.46,63.66 | v89.06,63.98 v91.92,61.12
  Bottom 0.635: IC2.10 114.78,59.69 v110.01,64.45 | v91.92,61.12 v94.46,63.66 | v89.06,63.98 86.52,66.52 84.77,66.52 83.19,64.93 T4.3
CAN3  (via drill 0.35)
  Top 0.635: v108.58,44.45 96.36,44.45 81.92,58.9 T4.4
  Bottom 0.635: IC2.12 118.75,54.61 v108.58,44.45
CAN4  (via drill 0.35)
  Top 0.635: IC3.3 106.2,54.61 101.44,59.37 101.44,60.33 v100.81,60.96
  Bottom 0.635: v100.81,60.96 101.44,61.59 101.44,65.41 97.47,69.37 92.23,69.37 87.95,73.66 86.04,73.66 80.64,68.26 T4.5
CAN5  (via drill 0.35)
  Top 0.635: IC3.5 107.79,59.69 v112.55,64.45 | v74.45,60.33 v74.45,64.14
  Bottom 0.635: v112.55,64.45 112.55,74.61 109.22,77.95 88.27,77.95 v74.45,64.14 | v74.45,60.33 77.47,60.33 79.38,62.23 T4.6
CAN6
  Top 0.635: IC3.10 95.89,59.69 89.69,65.88 87,65.88 86.36,66.52 79.69,66.52 78.11,64.93 T4.7
CGND  (via drill 0.35)
  Top 0.635: OK11.2 76.68,14.76 82.07,14.76 OK9.2 | OK10.2 92.71,17.62 94.61,19.53 98.58,19.53 OK12.2 103.35,14.76 104.78,14.76 106.52,16.51 OK13.2 | C8.2 C9.2 C10.2 | C10.2 C6.2 C5.2 C2.2 C7.2 47.47,40.16 v41.43,40.16 | v67.79,28.26 49.69,28.26 C10.2
  Bottom 0.635: OK13.2 112.24,14.76 117.63,14.76 117.79,14.92 | OK14.2 117.79,14.92 | OK15.2 124.3,16.51 122.56,14.76 117.95,14.76 117.79,14.92 | OK10.2 89.69,19.53 85.72,19.53 83.82,17.62 OK9.2 83.66,17.78 82.07,17.78 76.83,23.02 72.39,23.02 67.79,27.62 v67.79,28.26 | v41.43,40.16 27.15,40.16 25.88,38.89 25.88,28.1 15.56,17.78 14.61,17.78 T2.8
CIP0
  Top 0.635: T2.1 5.71,16.67 5.24,17.14 5.24,25.88 17.46,38.1 D1.A
CIP1
  Top 0.635: T2.2 6.99,25.08 17.46,35.56 D2.A
CIP2
  Bottom 0.635: D3.A 17.46,33.02 3.97,19.53 3.97,14.61 5.08,13.49 6.35,13.49 7.94,15.08 8.26,15.08 T2.3
CIP3
  Top 0.635: T2.4 9.53,22.54 17.46,30.48 D4.A
CIP4
  Top 0.635: D5.A 18.1,27.94 19.84,26.19 19.84,18.73 14.61,13.49 12.7,13.49 11.11,15.08 10.79,15.08 T2.5
CIP5
  Top 0.635: T2.6 12.06,20 17.46,25.4 D6.A
CIP6
  Top 0.635: D7.A 17.78,18.57 14.45,15.24 13.34,15.24 T2.7
COMM  (via drill 0.35)
  Top 0.635: OK4.4 55.4,47.47 48.74,47.47 OK1.4 | T3.8 5.71,63.66 5.24,64.14 5.24,65.41 17.78,77.95 45.09,77.95 46.35,76.68 v46.35,75.56 | v55.24,57.31 56.83,57.31 58.9,55.24 58.9,54.13 OK3.4
  Bottom 0.635: OK7.4 11.59,45.72 13.34,47.47 14.76,47.47 14.92,47.31 | OK6.4 14.92,47.31 | 26.04,46.35 24.92,47.47 15.08,47.47 14.92,47.31 | 26.04,46.35 OK5.4 | 26.04,46.35 28.1,48.42 34.13,48.42 OK2.4 38.58,47.47 45.24,47.47 OK1.4 | OK3.4 65.56,47.47 58.9,47.47 OK4.4 | v46.35,75.56 49.05,72.87 51.44,72.87 52.86,71.44 52.86,59.69 v55.24,57.31
COP0  (via drill 0.35)
  Top 0.635: v36.35,48.74 34.92,48.74 31.27,45.09 31.27,44.29 23.97,36.99 v23.97,36.83
  Bottom 0.635: OK4.3 49.37,45.72 46.35,48.74 v36.35,48.74 | v23.97,36.83 21.91,36.83 18.1,40.64 3.33,40.64 2.06,41.91 2.06,55.24 6.03,59.21 12.7,59.21 15.08,61.59 15.08,64.29 14.61,64.77 T3.1
COP1  (via drill 0.35)
  Top 0.635: v3.81,42.07 2.06,43.81 v2.06,57.78
  Bottom 0.635: OK3.3 60.8,45.72 57.63,42.55 4.29,42.55 v3.81,42.07 | v2.06,57.78 2.7,57.78 5.4,60.48 11.59,60.48 13.34,62.23 T3.2
COP2  (via drill 0.35)
  Top 0.635: OK1.3 44.45,49.37 36.04,57.78 23.65,57.78 18.26,63.18 v18.26,65.41
  Bottom 0.635: v18.26,65.41 16.35,65.41 15.24,66.52 13.65,66.52 12.06,64.93 T3.3
COP3  (via drill 0.35)
  Top 0.635: v28.57,46.99 23.97,51.59 23.5,51.59 14.92,60.17 12.86,60.17 10.79,62.23 T3.4
  Bottom 0.635: OK2.3 29.84,45.72 v28.57,46.99
COP4  (via drill 0.35)
  Top 0.635: OK5.3 24.13,48.42 v20.16,52.39 | v20.16,58.74 20.16,59.37 16.35,63.18 16.35,65.41 15.24,66.52 11.11,66.52 9.53,64.93 T3.5
  Bottom 0.635: v20.16,58.74 v20.16,52.39
COP5
  Top 0.635: OK6.3 13.97,50.96 8.26,56.67 T3.6
COP6  (via drill 0.35)
  Top 0.635: OK7.3 3.81,44.61 5.71,42.7 17.14,42.7 18.26,43.81 v18.26,54.29
  Bottom 0.635: v18.26,54.29 18.26,60.96 27.15,69.85 27.15,71.75 25.24,73.66 14.92,73.66 6.99,65.72 T3.7
D+  (via drill 0.35)
  Top 0.635: IC1.24 81.28,26.19 83.19,24.29 104.62,24.29 106.84,22.07 v112.39,22.07 | v118.43,22.07 120.02,22.07 123.98,18.1 v123.98,7.46 | v129.38,6.35 129.7,6.35 130.18,5.87 131.44,5.87 140.65,15.08 140.65,16.35 X1.3
  Bottom 0.635: v118.43,22.07 v112.39,22.07 | v123.98,7.46 126.05,7.46 127.64,5.87 128.91,5.87 v129.38,6.35
D-  (via drill 0.35)
  Top 0.635: IC1.23 78.74,34.92 80.8,36.99 83.82,36.99 87.15,33.66 90.81,33.66 v92.71,31.75 | v111.44,29.69 121.6,29.69 122.4,30.48 123.98,30.48 137.95,16.51 138.75,16.51 X1.2
  Bottom 0.635: v92.71,31.75 94.77,29.69 v111.44,29.69
GND
  Top 0.635: X1.S1 143.35,11.59 143.35,16.35 140.97,18.73 X1.4 140.81,18.89 140.81,20.95 143.35,23.5 X1.S2 143.35,23.81 143.35,24.29 PAD2.P$1 140.97,31.75 143.03,31.75 | 143.03,31.75 LED15.K | 143.19,36.51 143.03,36.35 143.03,31.75 | 143.19,36.51 LED16.K | 143.03,42.7 LED17.K | 143.03,42.7 143.03,36.67 143.19,36.51 | J1.2 141.45,66.36 144.3,63.5 144.3,61.75 J1.1 144.3,61.44 139.38,56.52 139.38,46.2 140.34,45.24 140.49,45.24 143.03,42.7 | D18.A D23.A | D18.A D21.A 97.95,76.36 105.09,76.36 106.68,77.95 120.17,77.95 D19.A | R14.1 LED7.K | LED6.K R12.1 55.4,10.64 49.37,10.64 49.21,10.48 | LED5.K R10.1 49.21,10.48 | LED4.K R8.1 42.86,10.48 | LED3.K R6.1 36.51,10.48 | LED1.K R2.1 25.24,9.05 25.24,14.29 21.11,18.41 21.11,36.51 30,45.4 30,51.59 | LED2.K R4.1 33.5,10.64 36.35,10.64 36.51,10.48 | 42.86,10.48 42.7,10.64 36.67,10.64 36.51,10.48 | 49.21,10.48 49.05,10.64 43.02,10.64 42.86,10.48 | IC1.31 99.06,27.15 96.36,29.84 | 96.36,29.84 92.08,29.84 C4.1 C3.1 | 96.36,29.84 96.52,30 96.52,30.48 97.16,31.11 97.16,35.4 93.98,38.58 IC1.12 93.98,42.39 87.15,49.21 86.36,49.21 C1.- 86.2,49.53 86.2,52.7 76.83,62.07 T4.8 76.83,62.55 76.36,63.02 76.36,65.41 84.61,73.66 D18.A | OK5.2 25.88,51.59 30,51.59 | 30,51.59 32.54,51.59 OK2.2
  Bottom 0.635: J2.3 133.19,35.56 138.43,30.32 PAD2.P$1 | IC2.11 119.86,57.15 123.03,60.33 123.03,66.52 | 123.03,66.52 123.03,67.47 D22.A D17.A D20.A D19.A | 123.03,66.52 141.29,66.52 J1.2 | LED1.K 26.67,3.81 R4.1 | R14.1 61.75,7.14 58.9,7.14 R12.1 | IC3.11 95.89,57.15 88.11,49.37 86.36,49.37 C1.- | LED14.K 26.83,76.2 28.57,77.95 30,77.95 30.16,77.79 | LED13.K 30.16,77.79 | 36.51,77.79 36.35,77.95 30.32,77.95 30.16,77.79 | 36.51,77.79 LED12.K | 42.86,77.79 42.7,77.95 36.67,77.95 36.51,77.79 | 42.86,77.79 LED11.K | 49.21,77.79 49.05,77.95 43.02,77.95 42.86,77.79 | 49.21,77.79 LED10.K | 55.56,77.79 55.4,77.95 49.37,77.95 49.21,77.79 | 55.56,77.79 LED9.K | 55.56,77.79 55.72,77.95 61.75,77.95 LED8.K 63.66,76.04 63.66,73.98 72.39,65.25 72.39,62.39 72.55,62.23 | OK7.2 5.56,51.59 12.22,51.59 OK6.2 17.62,49.69 21.27,49.69 24.13,52.55 OK5.2 | OK4.2 53.02,51.75 | 53.02,51.75 52.86,51.59 46.2,51.59 OK1.2 42.07,50.96 36.67,50.96 OK2.2 | 63.82,53.34 59.53,53.34 57.78,51.59 53.18,51.59 53.02,51.75 | 63.82,53.34 OK3.2 | 72.55,62.23 76.83,62.23 T4.8 | 72.55,62.23 63.82,53.5 63.82,53.34
  pour Top: 0.25,79.5 149.86,79.5 149.86,0 -0.25,0 -0.25,0.25 -0.25,79.76
  pour Bottom: 0.25,79.5 149.61,79.5 149.61,0.25 0,0.25 0,79.25
IP0  (via drill 0.35)
  Top 0.635: R2.2 R15.1 | OK9.3 83.82,11.27 v93.66,21.11
  Bottom 0.635: v93.66,21.11 99.06,21.11 104.14,26.19 IC1.33 | R2.2 25.4,17.62 33.81,9.21 33.81,8.26 36.2,5.87 79.38,5.87 82.39,8.89 OK9.3
IP1  (via drill 0.35)
  Top 0.635: R16.1 R4.2 31.91,18.89 33.34,18.89 36.51,15.72 v46.67,15.72 | OK10.3 92.71,10.32 v98.9,16.51
  Bottom 0.635: IC1.34 106.68,26.19 98.9,18.41 v98.9,16.51 99.06,16.35 96.2,13.49 82.55,13.49 81.6,14.45 74.61,14.45 73.03,16.03 68.1,16.03 67.79,15.72 v46.67,15.72
IP2  (via drill 0.35)
  Top 0.635: R6.2 R17.1 | v66.67,3.97 66.67,6.83 v65.72,7.78
  Bottom 0.635: 65.88,8.89 OK11.3 | 65.88,8.89 63.66,11.11 46.04,11.11 R6.2 | IC1.35 109.22,18.89 107.31,16.99 107.31,7.62 103.19,3.49 77.63,3.49 76.52,4.6 67.31,4.6 v66.67,3.97 | v65.72,7.78 65.72,8.73 65.88,8.89
IP3  (via drill 0.35)
  Top 0.635: R8.2 R18.1 | v101.6,12.7 OK12.3 | v107.31,23.5 109.06,23.5 111.76,26.19 IC1.36
  Bottom 0.635: v107.31,23.5 106.05,22.23 106.05,16.03 104.78,14.76 104.3,14.76 102.23,12.7 v101.6,12.7 101.12,12.22 81.92,12.22 80.96,13.18 73.98,13.18 72.39,14.76 68.74,14.76 68.42,14.45 55.4,14.45 55.24,14.29 46.2,14.29 44.45,16.03 R8.2
IP4  (via drill 0.35)
  Top 0.635: R19.1 R10.2 50.96,18.89 52.39,18.89 55.56,15.72 59.69,15.72 68.1,7.3 68.1,3.49 67.15,2.54 65.56,2.54 v65.25,2.86 | OK13.3 110.49,11.59 114.78,15.88 114.78,26.04 114.3,26.51 IC1.37
  Bottom 0.635: v65.25,2.86 65.88,2.86 66.52,2.22 103.82,2.22 OK13.3
IP5  (via drill 0.35)
  Top 0.635: R12.2 R20.1 | OK14.3 112.71,2.22 77.95,2.22 65.56,14.61 v65.56,17.62 | v130.33,19.53 131.44,19.53 v136.84,14.13 | v136.84,8.73 136.21,8.73 131.92,4.45 v126.36,4.45
  Bottom 0.635: IC1.38 116.84,26.19 120.02,23.02 127.16,23.02 | J2.6 127.16,23.02 | v65.56,17.62 64.45,17.62 64.14,17.3 58.9,17.3 R12.2 | v130.33,19.53 127.32,22.54 127.32,22.86 127.16,23.02 | v136.84,8.73 v136.84,14.13 | v126.36,4.45 122.71,4.45 119.38,7.78 OK14.3
IP6
  Top 0.635: R21.1 R14.2 63.66,18.89 63.66,14.61 77.31,0.95 120.33,0.95 OK15.3 128.27,14.13 125.25,17.14 125.25,20.32 119.38,26.19 IC1.39
  Bottom 0.635: IC1.39 119.38,26.19 121.28,24.29 124.78,24.29 130.97,30.48 J2.5
N$1
  Top 0.635: D1.C R1.1
N$2  (via drill 0.35)
  Top 0.635: C7.1 R1.2 | OK9.1 86.36,17.62 82.23,21.75 65.09,21.75 64.45,22.38 52.55,22.38 51.59,23.34 v51.59,24.92
  Bottom 0.635: v51.59,24.92 52.23,24.92 52.55,25.24 53.5,25.24 54.45,24.29 54.45,21.27 52.55,19.37 52.55,18.41 51.44,17.3 47.62,17.3 46.2,18.73 46.2,19.68 44.93,20.95 40.16,20.95 38.89,22.23 38.89,36.35 R1.2
N$3
  Top 0.635: D2.C R3.1
N$4
  Bottom 0.635: OK1.1 46.99,59.85 46.51,60.33 46.51,66.83 R25.2
N$5  (via drill 0.35)
  Top 0.635: C2.1 R3.2 | v53.82,35.24 v58.9,35.24
  Bottom 0.635: OK10.1 93.5,14.76 83.19,14.76 76.2,21.75 71.75,21.75 58.9,34.61 v58.9,35.24 | v53.82,35.24 53.82,35.88 51.44,38.26 51.44,38.73 50.16,40.01 48.9,40.01 C2.1
N$6
  Bottom 0.635: OK2.1 36.83,57.31 40.16,60.64 40.16,66.83 R26.2
N$7
  Top 0.635: D3.C R5.1
N$8
  Top 0.635: OK11.1 77.47,17.62 74.61,20.48 64.45,20.48 63.98,20.95 48.9,20.95 46.35,23.5 46.35,31.11 C5.1 R5.2
N$9
  Top 0.635: D4.C R7.1
N$10  (via drill 0.35)
  Top 0.635: OK12.1 104.14,17.62 98.74,23.02 66.36,23.02 65.56,23.81 v53.02,23.81 | C6.1 R7.2
  Bottom 0.635: v53.02,23.81 50.16,20.95 48.9,20.95 46.35,23.5 46.35,28.57 C6.1
N$11
  Top 0.635: D5.C R9.1
N$12  (via drill 0.35)
  Top 0.635: C10.1 R9.2 40.48,27.78 38.89,27.78 38.26,27.15 37.31,27.15 31.43,21.27 31.11,21.27 30.96,21.11 30,21.11 29.84,21.27 29.21,21.27 28.89,20.95 28.73,20.95 27.62,19.84 27.62,19.68 27.46,19.53 27.46,18.57 27.62,18.41 27.62,18.26 28.89,16.99 32.23,16.99 36.2,13.02 47.15,13.02 47.31,13.18 54.77,13.18 v55.4,12.54 | OK13.1 110.97,14.45 108.9,14.45 107.63,13.18 105.25,13.18 v103.98,11.91
  Bottom 0.635: v103.98,11.91 103.35,11.91 102.23,10.79 101.28,10.79 101.12,10.95 96.04,10.95 95.89,10.79 93.66,10.79 93.5,10.95 81.28,10.95 80.33,11.91 71.75,11.91 70.17,13.49 69.37,13.49 69.06,13.18 56.04,13.18 v55.4,12.54
N$13
  Top 0.635: D6.C R11.1
N$14  (via drill 0.35)
  Top 0.635: OK14.1 121.92,13.81 115.09,6.99 115.09,6.51 112.08,3.49 85.57,3.49 v70.48,18.57
  Bottom 0.635: v70.48,18.57 70.48,21.11 52.7,38.89 52.7,39.37 50.8,41.27 45.09,41.27 42.39,38.58 42.39,27.3 | 42.39,27.3 42.39,27.15 R11.2 | C9.1 42.55,27.3 42.39,27.3
N$15
  Top 0.635: OK3.1 67.31,54.45 62.55,59.21 60.33,59.21 58.9,60.64 58.9,69.37 R27.2
N$16
  Top 0.635: D7.C R13.1
N$17  (via drill 0.35)
  Top 0.635: OK15.1 130.81,11.27 v132.72,9.37 | v59.05,3.33 59.05,10.79 55.4,14.45 50.48,14.45 46.2,18.73 46.2,21.11 C8.1 R13.2
  Bottom 0.635: v132.72,9.37 132.72,7.14 126.52,0.95 61.44,0.95 v59.05,3.33
N$18
  Top 0.635: R15.2 LED1.A
N$19
  Top 0.635: R16.2 LED2.A
N$20
  Bottom 0.635: OK4.1 57.15,58.58 59.21,60.64 59.21,65.41 63.5,69.69 R28.2
N$21
  Top 0.635: LED8.A R22.2
N$22
  Top 0.635: R17.2 LED3.A
N$23
  Top 0.635: R18.2 LED4.A
N$24
  Top 0.635: R19.2 LED5.A
N$25
  Top 0.635: R20.2 LED6.A
N$26
  Top 0.635: R21.2 LED7.A
N$27
  Bottom 0.635: OK5.1 33.81,60.48 33.81,66.83 R29.2
N$28
  Top 0.635: LED9.A R23.2
N$29
  Top 0.635: LED10.A R24.2
N$30
  Top 0.635: LED11.A R32.2
N$31
  Top 0.635: LED12.A R34.2
N$32
  Bottom 0.635: OK6.1 17.3,53.34 19.68,50.96 20.64,50.96 21.59,51.91 21.59,59.85 21.11,60.33 21.11,61.59 28.89,69.37 30,69.37 R30.2
N$33
  Top 0.635: LED13.A R35.2
N$34
  Top 0.635: LED14.A R36.2
N$35
  Bottom 0.635: OK7.1 8.73,53.34 25.4,70.01 R31.2
N$36
  Bottom 0.635: LED15.A 147.8,32.23 147.8,51.59 R37.2
N$37
  Top 0.635: LED16.A 147.8,38.58 147.8,49.05 R38.2
N$38
  Top 0.635: LED17.A 146.53,43.66 146.53,47.78 R39.2
OK  (via drill 0.35)
  Top 0.635: v95.73,67.47 96.36,67.47 97.16,68.26 108.27,68.26 110.17,66.36 118.11,66.36 118.27,66.52 128.27,66.52 132.56,62.23 132.56,57.15 134.62,55.09 136.53,55.09 137.64,53.98 137.64,50.01 R39.1
  Bottom 0.635: IC1.16 83.82,55.56 v95.73,67.47
OP0
  Top 0.635: IC1.19 76.2,48.26 R28.1 R22.1
OP1  (via drill 0.35)
  Top 0.635: R27.1 R23.1 | v76.36,50.8 76.36,53.02 65.25,64.14 65.25,71.75 64.14,72.87 v62.87,72.87
  Bottom 0.635: IC1.20 73.66,48.1 v76.36,50.8 | v62.87,72.87 60.33,72.87 58.9,71.44 58.9,66.99 57.15,65.25 R27.1
OP2
  Top 0.635: IC1.21 73.66,31.91 50.8,54.77 R25.1 R24.1
OP3
  Top 0.635: R32.1 R26.1 46.2,62.71 51.44,62.71 52.55,61.59 52.55,60.64 53.98,59.21 56.83,59.21 60.17,55.88 60.17,55.56 69.06,46.67 69.06,41.59 76.2,34.45 IC1.22
OP4  (via drill 0.35)
  Top 0.635: R34.1 R29.1 38.26,60.8 38.26,59.69 41.59,56.36 v42.23,56.36 | v71.75,31.27 71.75,31.91 66.52,37.15 57.63,37.15 57.47,36.99 56.52,36.99 55.24,38.26 55.24,39.21 51.91,42.55 43.66,42.55 42.39,43.81 42.39,49.21 v39.21,52.39
  Bottom 0.635: IC1.27 88.9,28.1 87.47,29.53 73.5,29.53 v71.75,31.27 | v39.21,52.39 39.21,53.34 v42.23,56.36
OP5  (via drill 0.35)
  Top 0.635: R35.1 R30.1 33.5,62.71 38.73,62.71 39.85,61.59 39.85,60.64 41.27,59.21 44.77,59.21 48.74,55.24 48.74,54.93 53.34,50.32 v53.34,49.69 | IC1.28 91.44,27.15 88.74,29.84 87,29.84 v81.28,35.56
  Bottom 0.635: v81.28,35.56 75.09,35.56 69.06,41.59 69.06,46.35 65.72,49.69 v53.34,49.69
OP6  (via drill 0.35)
  Top 0.635: R36.1 R31.1 28.42,63.98 46.04,63.98 52.55,70.48 52.55,76.52 53.98,77.95 64.14,77.95 66.52,75.56 66.52,71.91 72.39,66.04 v72.39,59.53 | v75.56,37.62 74.93,37.62 70.8,41.75 v70.8,51.12
  Bottom 0.635: IC1.29 93.98,26.19 92.08,24.29 73.03,24.29 70.33,26.99 70.33,31.75 72.71,34.13 81.76,34.13 82.71,35.08 82.71,36.04 81.12,37.62 v75.56,37.62 | v70.8,51.12 70.8,57.94 v72.39,59.53
OSC1
  Top 0.635: IC1.14 88.9,39.37 20M.2
  Bottom 0.635: 20M.2 86.36,35.56 C3.2
OSC2
  Top 0.635: IC1.13 20M.1 95.25,33.02 C4.2
PGD
  Bottom 0.635: J2.4 130.97,33.02 124.62,26.67 121.92,26.67 IC1.40
POW  (via drill 0.35)
  Top 0.635: R38.1 133.83,48.74 133.83,44.13 134.94,43.02 134.94,31.27 136.21,30 136.21,25.88 134.46,24.13 v134.46,23.81 | v122.87,29.05 v129.06,22.86 | v100.81,38.73 96.04,38.73 v95.89,38.58
  Bottom 0.635: v134.46,23.81 130.02,23.81 v129.06,22.86 | v122.87,29.05 122.24,29.69 119.06,29.69 118.9,29.53 114.14,29.53 105.57,38.1 101.44,38.1 v100.81,38.73 | v95.89,38.58 93.66,38.58 93.34,38.89 88.9,38.89 86.36,41.43 IC1.15
REST
  Top 0.635: R33.1 121.92,41.91 IC1.1
  Bottom 0.635: PAD1.P$1 134.46,39.37 133.19,40.64 J2.1 130.81,41.91 R33.1
VUSB
  Top 0.635: IC1.18 78.74,42.39 83.5,47.15 86.36,47.15 C1.+